# Altium schematic sheet cpu sheet.SchDoc
size A4; SheetNumber: 1; SheetTotal: 4
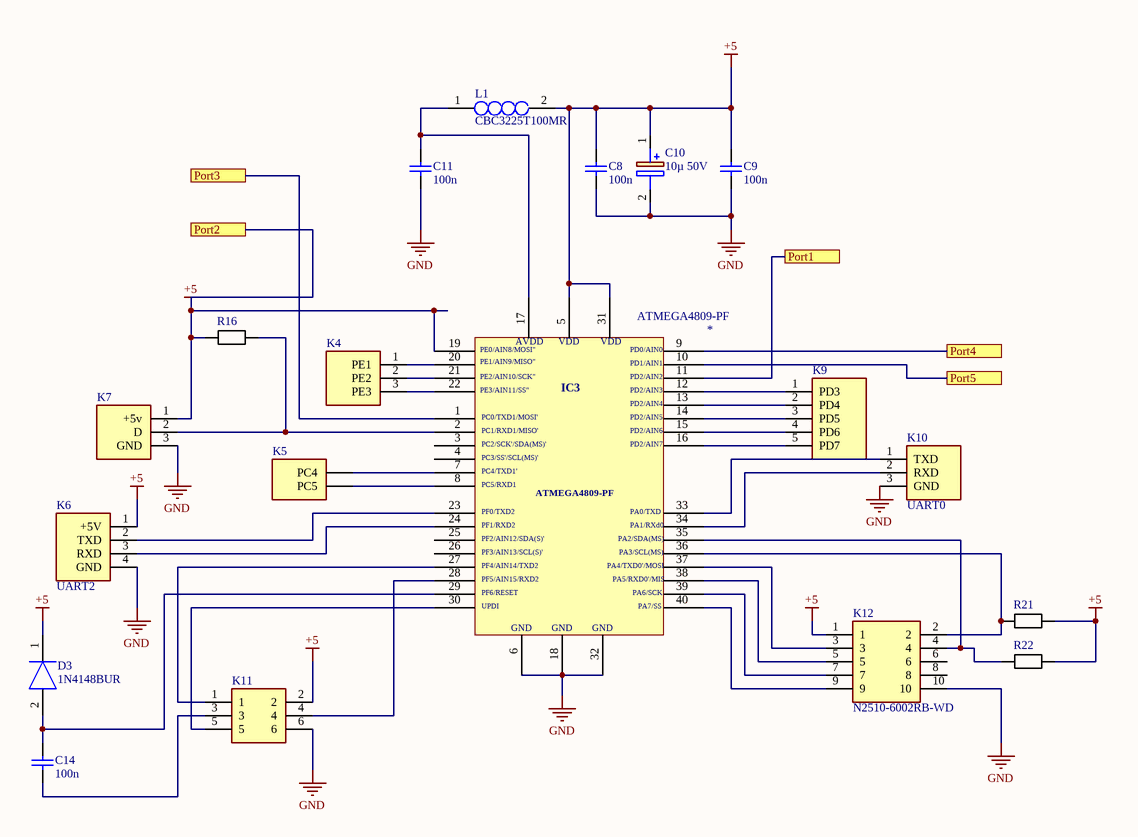
[diagram p0: cpu sheet.SchDoc]

## Parts
*  ATMEGA4809-PF  [DIP1543W47P254L5321H635Q40]
C8  100n  [LIBRARYSOURCE=Vault]
C9  100n  [LIBRARYSOURCE=Vault]
C10  10µ 50V  [CAPPRD500W65D1025H1250]
C11  100n  [LIBRARYSOURCE=Vault]
C14  100n  [LIBRARYSOURCE=Vault]
D3  1N4148BUR  [1N4148BUR]
K4  10129378-903001BLF  [HDRV3W67P0X254_1X3_762X241X858P]  (value not drawn)
K5  10129378-902001BLF  [HDRV2W67P0X254_1X2_508X241X843P]  (value not drawn)
K6  UART2  [HDRV4W67P0X254_1X4_1270X241X858P]
K7  10129378-903001BLF  [HDRV3W67P0X254_1X3_762X241X858P]  (value not drawn)
K9  10129378-905001BLF  [HDRV5W67P0X254_1X5_1270X241X858P]  (value not drawn)
K10  UART0  [HDRV3W67P0X254_1X3_762X241X858P]
K11  10129381-906002BLF  [HDRV6W67P254_2X3_762X483X858P]  (value not drawn)
K12  N2510-6002RB-WD  [N25106002RBWD]
L1  CBC3225T100MR  [INDC3225X270N]
R16  CRCW08050000Z0EA  [RESC2012X65N]  (value not drawn)
R21  CRCW08050000Z0EA  [RESC2012X65N]  (value not drawn)
R22  CRCW08050000Z0EA  [RESC2012X65N]  (value not drawn)

## Ports
Port1, Port2, Port3, Port4, Port5

## Nets
+5: *.5 *.19 *.31 C8.2 C9.2 C10.1(+) D3.1(K) K6.1(+5V) K7.1(+5v) K11.2 K12.1 L1.2 R16.1 R21.2 R22.2 ; port Port2
GND: *.6 *.18 *.32 C8.1 C9.1 C10.2(-) C11.1 K6.4(GND) K7.3(GND) K10.3(GND) K11.6 K12.10
Port1: *.11 ; port Port1
Port3: *.1 ; port Port3
Port4: *.9 ; port Port4
Port5: *.10 ; port Port5
Net*_2: *.2 K7.2(D) R16.2
Net*_7: *.7 K5.PC4
Net*_8: *.8 K5.PC5
Net*_12: *.12 K9.1(PD3)
Net*_13: *.13 K9.2(PD4)
Net*_14: *.14 K9.3(PD5)
Net*_15: *.15 K9.4(PD6)
Net*_16: *.16 K9.5(PD7)
Net*_17: *.17 C11.2 L1.1
Net*_20: *.20 K4.1(PE1)
Net*_21: *.21 K4.2(PE2)
Net*_22: *.22 K4.3(PE3)
Net*_23: *.23 K6.2(TXD)
Net*_24: *.24 K6.3(RXD)
Net*_27: *.27 K11.1
Net*_28: *.28 K11.4
Net*_29: *.29 C14.2 D3.2(A)
Net*_30: *.30 K11.5
Net*_33: *.33 K10.1(TXD)
Net*_34: *.34 K10.2(RXD)
Net*_35: *.35 K12.4 R22.1
Net*_36: *.36 K12.2 R21.1
Net*_37: *.37 K12.3
Net*_38: *.38 K12.5
Net*_39: *.39 K12.7
Net*_40: *.40 K12.9
NetC14_1: C14.1 K11.3

Not connected (* = marked no-connect by the designer): * 3 4 25 26; K12 6 8

## Notes on the sheet
- (in symbol ATMEGA4809-PF) AVDD; VDD; PE0/AIN8/MOSI"; PD0/AIN0; PE1/AIN9/MISO"; PD1/AIN1; PE2/AIN10/SCK"; PD2/AIN2; PE3/AIN11/SS"; IC3; PD2/AIN3; PD2/AIN4; PC0/TXD1/MOSI'; PD2/AIN5; PC1/RXD1/MISO'; PD2/AIN6; PC2/SCK'/SDA(MS)'; PD2/AIN7; PC3/SS'/SCL(MS)'; PC4/TXD1'; PC5/RXD1; PF0/TXD2; PA0/TXD; PF1/RXD2; PA1/RXd0; PF2/AIN12/SDA(S)'; PA2/SDA(MS); PF3/AIN13/SCL(S)'; PA3/SCL(MS); PF4/AIN14/TXD2; PA4/TXD0'/MOSI; PF5/AIN15/RXD2; PA5/RXD0'/MIS; PF6/RESET; PA6/SCK; UPDI; PA7/SS; GND

## Library data of the parts
C8 C9 C11 C14 = CAP: Part Number: 02015A270JAT2A; Manufacturer: AVX Interconnect / Elco
C10 = B41851A6227M000: Capacitor Polarised; Manufacturer_Name: TDK; Datasheet Link: https://altium.componentsearchengine.com/Datasheets/1/B41851A6227M000.pdf; Height: 12.5mm; Manufacturer_Part_Number: B41851A6227M000; Mouser Part Number: 871-B41851A6227M000; Mouser Price/Stock: http://www.mouser.com/Search/ProductDetail.aspx?qs=DFkWJ3l%252bHdIsXImfYI6EYQ%3d%3d; Arrow Part Number: B41851A6227M000; Arrow Price/Stock: https://www.arrow.com/en/products/b41851a6227m000/epcos-tdk
D3 = 1N4148BUR: Diode; Manufacturer_Name: Vishay; Datasheet Link: https://www.mouser.com/datasheet/2/427/ll4148-1767723.pdf; Height: 1.6mm; Manufacturer_Part_Number: 1N4148BUR
K4 K7 K10 = 10129378-903001BLF: Connector; Manufacturer_Name: Amphenol; Datasheet Link: https://www.mouser.com/datasheet/2/18/10129378-1530218.pdf; Height: 8.58mm; Manufacturer_Part_Number: 10129378-903001BLF; Mouser Part Number: 649-1012937890301BLF; Mouser Price/Stock: https://www.mouser.co.uk/ProductDetail/Amphenol-FCI/10129378-903001BLF?qs=0lQeLiL1qybuYTJnitumiA%3D%3D; Arrow Part Number: 10129378-903001BLF; Arrow Price/Stock: https://www.arrow.com/en/products/10129378-903001blf/amphenol-fci?region=nac
K5 = 10129378-902001BLF: Connector; Manufacturer_Name: Amphenol; Datasheet Link: https://www.mouser.co.uk/datasheet/2/18/10129378-1530218.pdf; Height: 8.43mm; Manufacturer_Part_Number: 10129378-902001BLF; Mouser Part Number: 649-1012937890201BLF; Mouser Price/Stock: https://www.mouser.co.uk/ProductDetail/Amphenol-FCI/10129378-902001BLF?qs=0lQeLiL1qybv6C1q0T3%2FPw%3D%3D; Arrow Part Number: 10129378-902001BLF; Arrow Price/Stock: https://www.arrow.com/en/products/10129378-902001blf/amphenol-fci?region=nac
K6 = 10129378-904001BLF: Connector; Manufacturer_Name: Amphenol; Datasheet Link: https://cdn.amphenol-icc.com/media/wysiwyg/files/drawing/10129378.pdf; Height: 8.58mm; Manufacturer_Part_Number: 10129378-904001BLF; Mouser Part Number: 649-1012937890401BLF; Mouser Price/Stock: https://www.mouser.co.uk/ProductDetail/Amphenol-FCI/10129378-904001BLF?qs=0lQeLiL1qyYgZuNoMLioxA%3D%3D; Arrow Part Number: 10129378-904001BLF; Arrow Price/Stock: https://www.arrow.com/en/products/10129378-904001blf/amphenol-fci?region=nac
K9 = 10129378-905001BLF: Connector; Manufacturer_Name: FCI Electronics; Datasheet Link: https://cdn.amphenol-icc.com/media/wysiwyg/files/drawing/10129378.pdf; Height: 8.58mm; Manufacturer_Part_Number: 10129378-905001BLF; Mouser Part Number: 649-1012937890501BLF; Mouser Price/Stock: https://www.mouser.com/Search/Refine.aspx?Keyword=649-1012937890501BLF
K11 = 10129381-906002BLF: Connector; Manufacturer_Name: Amphenol; Datasheet Link: https://componentsearchengine.com/Datasheets/1/10129381-906002BLF.pdf; Height: 8.58mm; Manufacturer_Part_Number: 10129381-906002BLF; Mouser Part Number: 649-1012938190602BLF; Mouser Price/Stock: https://www.mouser.co.uk/ProductDetail/Amphenol-FCI/10129381-906002BLF?qs=DXv0QSHKF4zSKXKyBbBVMw%3D%3D; Arrow Part Number: 10129381-906002BLF; Arrow Price/Stock: https://www.arrow.com/en/products/10129381-906002blf/amphenol-fci?region=europe
K12 = N2510-6002RB-WD: Connector; Manufacturer_Name: 3M; Datasheet Link: https://componentsearchengine.com/Datasheets/1/N2510-6002RB-WD.pdf; Height: 10.04mm; Manufacturer_Part_Number: N2510-6002RB-WD; Mouser Part Number: 517-N2510-6002RB-WD; Mouser Price/Stock: https://www.mouser.co.uk/ProductDetail/3M-Electronic-Solutions-Division/N2510-6002RB-WD?qs=tSsi4D7a3EKnZz6HvOFNDw%3D%3D; Arrow Part Number: N2510-6002RB-WD; Arrow Price/Stock: https://www.arrow.com/en/products/n2510-6002rb-wd/3m?region=nac
L1 = CBC3225T100MR: Inductor; Manufacturer_Name: TAIYO YUDEN; Datasheet Link: https://www.mouser.com/datasheet/2/396/wound02_e-13113-1206718.pdf; Height: 2.7mm; Manufacturer_Part_Number: CBC3225T100MR; Mouser Part Number: 963-CBC3225T100MR; Mouser Price/Stock: https://www.mouser.co.uk/ProductDetail/Taiyo-Yuden/CBC3225T100MR?qs=I6KAKw0tg2zEtdnRpTP1sA%3D%3D
R16 R21 R22 = RES: Manufacturer: Vishay Dale; Part Number: CRCW08050000Z0EA